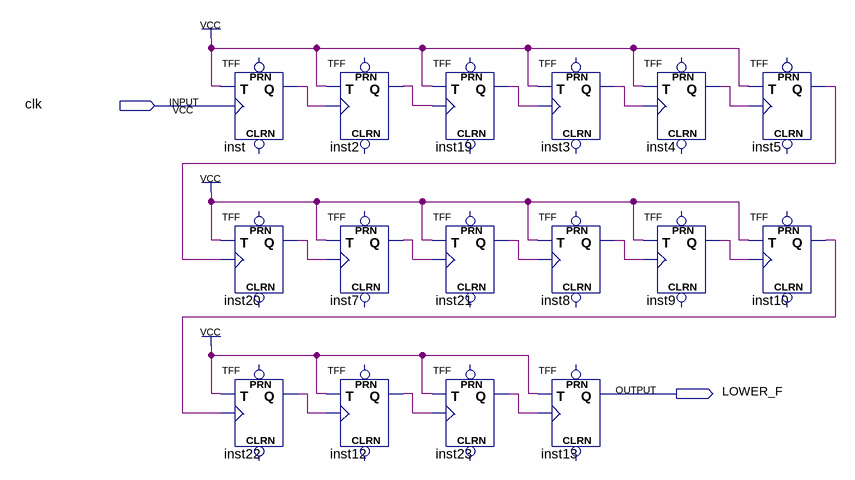
[diagram p0: schematic sheet]
// Quartus schematic FD.bdf as structural Verilog: 16 symbols, 2 pins
module FD (
  input  clk,
  output LOWER_F
);

  wire inst2_q, inst3_q, inst4_q, inst5_q, inst7_q, inst8_q, inst9_q, inst10_q, inst12_q, inst19_q, inst20_q,
       inst21_q, inst22_q, inst23_q, inst_q;

  TFF inst (.T(1'b1), .CLK(clk), .Q(inst_q));  // open: PRN, CLRN
  TFF inst20 (.T(1'b1), .CLK(inst5_q), .Q(inst20_q));  // open: PRN, CLRN
  TFF inst22 (.T(1'b1), .CLK(inst10_q), .Q(inst22_q));  // open: PRN, CLRN
  TFF inst2 (.T(1'b1), .CLK(inst_q), .Q(inst2_q));  // open: PRN, CLRN
  TFF inst7 (.T(1'b1), .CLK(inst20_q), .Q(inst7_q));  // open: PRN, CLRN
  TFF inst12 (.T(1'b1), .CLK(inst22_q), .Q(inst12_q));  // open: PRN, CLRN
  TFF inst19 (.T(1'b1), .CLK(inst2_q), .Q(inst19_q));  // open: PRN, CLRN
  TFF inst21 (.T(1'b1), .CLK(inst7_q), .Q(inst21_q));  // open: PRN, CLRN
  TFF inst23 (.T(1'b1), .CLK(inst12_q), .Q(inst23_q));  // open: PRN, CLRN
  TFF inst3 (.T(1'b1), .CLK(inst19_q), .Q(inst3_q));  // open: PRN, CLRN
  TFF inst8 (.T(1'b1), .CLK(inst21_q), .Q(inst8_q));  // open: PRN, CLRN
  TFF inst13 (.T(1'b1), .CLK(inst23_q), .Q(LOWER_F));  // open: PRN, CLRN
  TFF inst4 (.T(1'b1), .CLK(inst3_q), .Q(inst4_q));  // open: PRN, CLRN
  TFF inst9 (.T(1'b1), .CLK(inst8_q), .Q(inst9_q));  // open: PRN, CLRN
  TFF inst5 (.T(1'b1), .CLK(inst4_q), .Q(inst5_q));  // open: PRN, CLRN
  TFF inst10 (.T(1'b1), .CLK(inst9_q), .Q(inst10_q));  // open: PRN, CLRN
endmodule
